# Altium schematic sheet ledmat.SchDoc
size A4
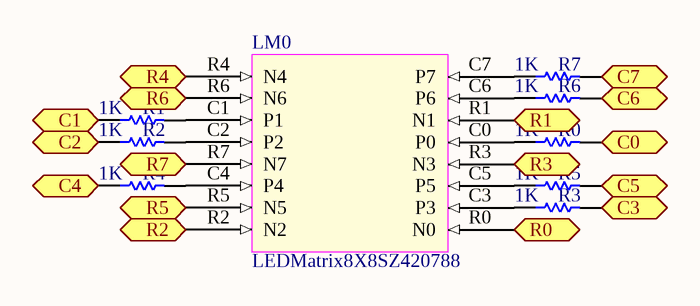
[diagram p0: ledmat.SchDoc]

## Parts
LM0  LEDMatrix8X8SZ420788  [SZ20788]
R0  value 1K  [0805]  (hidden comment: Res1)
R1  value 1K  [0805]  (hidden comment: Res1)
R2  value 1K  [0805]  (hidden comment: Res1)
R3  value 1K  [0805]  (hidden comment: Res1)
R4  value 1K  [0805]  (hidden comment: Res1)
R5  value 1K  [0805]  (hidden comment: Res1)
R6  value 1K  [0805]  (hidden comment: Res1)
R7  value 1K  [0805]  (hidden comment: Res1)

## Ports
C0, C1, C2, C3, C4, C5, C6, C7, R0, R1, R2, R3, R4, R5, R6, R7

## Nets
C0: R0.2 ; port C0
C1: R1.1 ; port C1
C2: R2.1 ; port C2
C3: R3.2 ; port C3
C4: R4.1 ; port C4
C5: R5.2 ; port C5
C6: R6.2 ; port C6
C7: R7.2 ; port C7
R0: LM0.R0(N0) ; port R0
R1: LM0.R1(N1) ; port R1
R2: LM0.R2(N2) ; port R2
R3: LM0.R3(N3) ; port R3
R4: LM0.R4(N4) ; port R4
R5: LM0.R5(N5) ; port R5
R6: LM0.R6(N6) ; port R6
R7: LM0.R7(N7) ; port R7
NetLM0_C0: LM0.C0(P0) R0.1
NetLM0_C1: LM0.C1(P1) R1.2
NetLM0_C2: LM0.C2(P2) R2.2
NetLM0_C3: LM0.C3(P3) R3.1
NetLM0_C4: LM0.C4(P4) R4.2
NetLM0_C5: LM0.C5(P5) R5.1
NetLM0_C6: LM0.C6(P6) R6.1
NetLM0_C7: LM0.C7(P7) R7.1

## Library data of the parts
R0-R7 = Res1: Resistor; Published: 8-Jun-2000; LatestRevisionDate: 17-Jul-2002; LatestRevisionNote: Re-released for DXP Platform.; PackageReference: AXIAL-0.3; Publisher: Altium Limited